# Altium schematic sheet Power.SchDoc
size A4
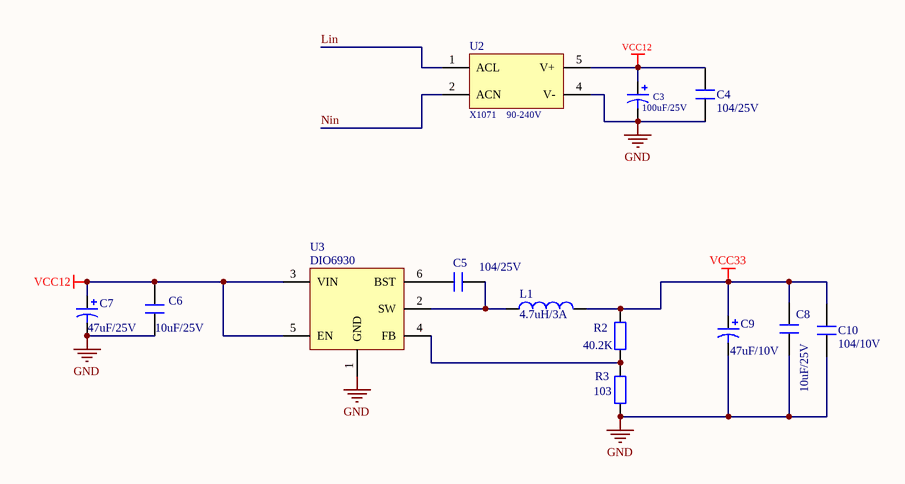
[diagram p0: Power.SchDoc]

## Parts
C3  100uF/25V  [CAPPIND06]
C4  104/25V  [0603R]
C5  104/25V  [0603R]
C6  10uF/25V  [0603R]
C7  47uF/25V  [0805R]
C8  10uF/25V  [0603R]
C9  47uF/10V  [0805R]
C10  104/10V  [0603R]
L1  4.7uH/3A  [贴片电感5020]
R2  40.2K  [0603R]
R3  103  [0603R]
U2  X1071    90-240V  [X1071]
U3  DIO6930  [SOT-23-6DBV]

## Nets
GND: C3.2 C4.1 C6.1 C7.2 C8.1 C9.2 C10.1 R3.2 U2.4(V-) U3.1(GND)
VCC12: C3.1 C4.2 C6.2 C7.1 U2.5(V+) U3.3(VIN) U3.5(EN)
VCC33: C8.2 C9.1 C10.2 L1.2 R2.1
Lin: U2.1(ACL)
Nin: U2.2(ACN)
NetC5_1: C5.1 L1.1 U3.2(SW)
NetC5_2: C5.2 U3.6(BST)
NetR2_2: R2.2 R3.1 U3.4(FB)

## Library data of the parts
C3 C7 C9 = Cap Pol1: Polarized Capacitor (Radial); Published: 8-Jun-2000; LatestRevisionDate: 17-Jul-2002; LatestRevisionNote: Re-released for DXP Platform.; PackageReference: RB7.6-15; Publisher: Altium Limited; PackageDescription: Polarized Capacitor (Radial); 2 Leads
C4 C5 C10 = CAP_1
C6 C8 = CAP
L1 = Inductor: Code_IEC: 1005; Published: 8-Jun-2000; LatestRevisionDate: 29-May-2009; LatestRevisionNote: IPC-7351 Footprint Added.; PackageReference: 0402-A; Publisher: Altium Limited; PackageDescription: Chip Inductor; Code_JEITA: 0402
R2 R3 = Res2: Resistor; Published: 8-Jun-2000; LatestRevisionDate: 17-Jul-2002; LatestRevisionNote: Re-released for DXP Platform.; PackageReference: AXIAL-0.4; Publisher: Altium Limited; PackageDescription: Axial Device, Thru-Hole; 2 Leads; 0.4 in Pin Spacing
U2 = AD2DC_EMC
U3 = BL8032